# EasyEDA schematic BIT 6.json
TITLE: TRICORE | ALU | CMP; REV: 1.0; Date: 2022-01-05; Sheet: 2/8; Drawn By: Koehler, Paul; Company: komed3
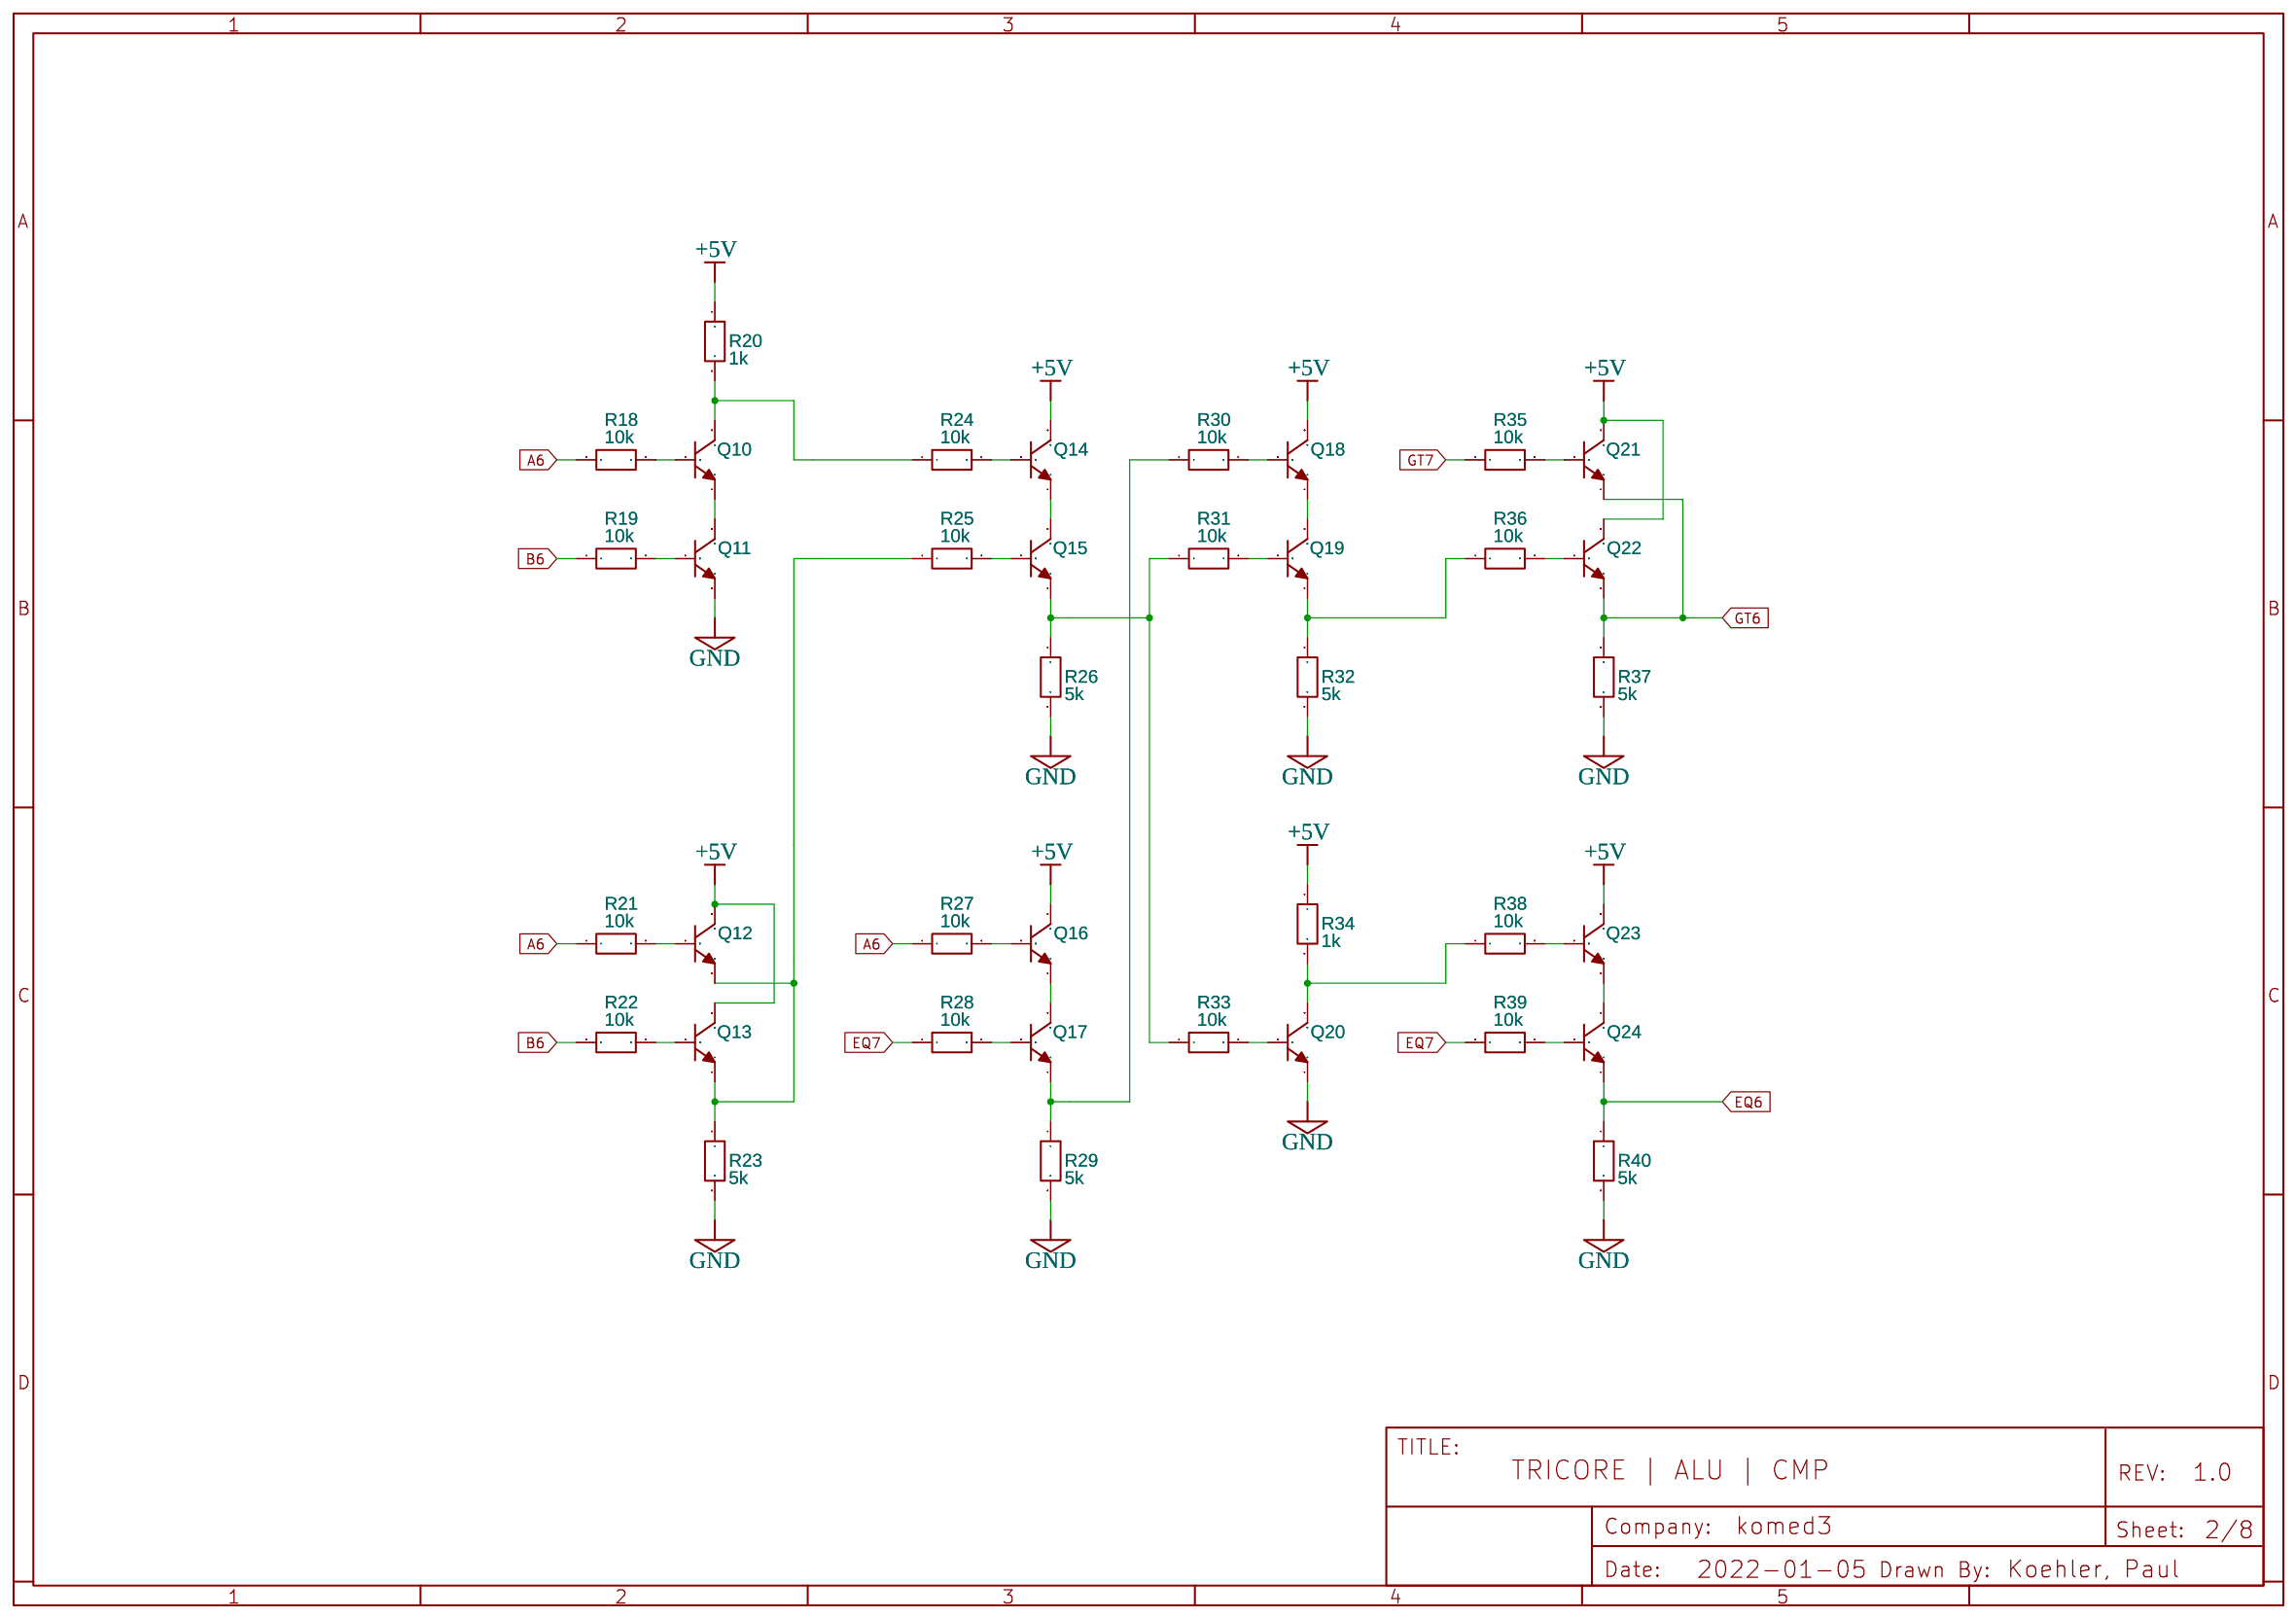
[diagram p0: schematic sheet]

## Parts
Q10  2N3904(TO-92)  [TO-92-3_L5.1-W4.1-P1.27-L]
Q11  2N3904(TO-92)  [TO-92-3_L5.1-W4.1-P1.27-L]
Q12  2N3904(TO-92)  [TO-92-3_L5.1-W4.1-P1.27-L]
Q13  2N3904(TO-92)  [TO-92-3_L5.1-W4.1-P1.27-L]
Q14  2N3904(TO-92)  [TO-92-3_L5.1-W4.1-P1.27-L]
Q15  2N3904(TO-92)  [TO-92-3_L5.1-W4.1-P1.27-L]
Q16  2N3904(TO-92)  [TO-92-3_L5.1-W4.1-P1.27-L]
Q17  2N3904(TO-92)  [TO-92-3_L5.1-W4.1-P1.27-L]
Q18  2N3904(TO-92)  [TO-92-3_L5.1-W4.1-P1.27-L]
Q19  2N3904(TO-92)  [TO-92-3_L5.1-W4.1-P1.27-L]
Q20  2N3904(TO-92)  [TO-92-3_L5.1-W4.1-P1.27-L]
Q21  2N3904(TO-92)  [TO-92-3_L5.1-W4.1-P1.27-L]
Q22  2N3904(TO-92)  [TO-92-3_L5.1-W4.1-P1.27-L]
Q23  2N3904(TO-92)  [TO-92-3_L5.1-W4.1-P1.27-L]
Q24  2N3904(TO-92)  [TO-92-3_L5.1-W4.1-P1.27-L]
R18  10k  [R_AXIAL-0.3]
R19  10k  [R_AXIAL-0.3]
R20  1k  [R_AXIAL-0.3]
R21  10k  [R_AXIAL-0.3]
R22  10k  [R_AXIAL-0.3]
R23  5k  [R_AXIAL-0.3]
R24  10k  [R_AXIAL-0.3]
R25  10k  [R_AXIAL-0.3]
R26  5k  [R_AXIAL-0.3]
R27  10k  [R_AXIAL-0.3]
R28  10k  [R_AXIAL-0.3]
R29  5k  [R_AXIAL-0.3]
R30  10k  [R_AXIAL-0.3]
R31  10k  [R_AXIAL-0.3]
R32  5k  [R_AXIAL-0.3]
R33  10k  [R_AXIAL-0.3]
R34  1k  [R_AXIAL-0.3]
R35  10k  [R_AXIAL-0.3]
R36  10k  [R_AXIAL-0.3]
R37  5k  [R_AXIAL-0.3]
R38  10k  [R_AXIAL-0.3]
R39  10k  [R_AXIAL-0.3]
R40  5k  [R_AXIAL-0.3]

## Library data of the parts
Q10-Q24 = 2N3904(TO-92): Supplier: LCSC; Manufacturer: SEMTECH; Manufacturer Part: 2N3904; Supplier Part: C118538; Contributor: LCEDA_Lib
R18-R40 = R_AXIAL-0.3_EU: Contributor: LCEDA_Lib

## Nets
+5V: Q12.3(C) Q13.3(C) Q14.3(C) Q16.3(C) Q18.3(C) Q21.3(C) Q22.3(C) Q23.3(C) R20.1 R34.1
GND: Q11.1(E) Q20.1(E) R23.2 R26.2 R29.2 R32.2 R37.2 R40.2
A6: R18.1 R21.1 R27.1
B6: R19.1 R22.1
EQ6: Q24.1(E) R40.1
EQ7: R28.1 R39.1
GT6: Q21.1(E) Q22.1(E) R37.1
GT7: R35.1
Net-(Q10-1): Q10.1(E) Q11.3(C)
Net-(Q10-2): Q10.2(B) R18.2
Net-(Q10-3): Q10.3(C) R20.2 R24.1
Net-(Q11-2): Q11.2(B) R19.2
Net-(Q12-1): Q12.1(E) Q13.1(E) R23.1 R25.1
Net-(Q12-2): Q12.2(B) R21.2
Net-(Q13-2): Q13.2(B) R22.2
Net-(Q14-1): Q14.1(E) Q15.3(C)
Net-(Q14-2): Q14.2(B) R24.2
Net-(Q15-1): Q15.1(E) R26.1 R31.1 R33.1
Net-(Q15-2): Q15.2(B) R25.2
Net-(Q16-1): Q16.1(E) Q17.3(C)
Net-(Q16-2): Q16.2(B) R27.2
Net-(Q17-1): Q17.1(E) R29.1 R30.1
Net-(Q17-2): Q17.2(B) R28.2
Net-(Q18-1): Q18.1(E) Q19.3(C)
Net-(Q18-2): Q18.2(B) R30.2
Net-(Q19-1): Q19.1(E) R32.1 R36.1
Net-(Q19-2): Q19.2(B) R31.2
Net-(Q20-2): Q20.2(B) R33.2
Net-(Q20-3): Q20.3(C) R34.2 R38.1
Net-(Q21-2): Q21.2(B) R35.2
Net-(Q22-2): Q22.2(B) R36.2
Net-(Q23-1): Q23.1(E) Q24.3(C)
Net-(Q23-2): Q23.2(B) R38.2
Net-(Q24-2): Q24.2(B) R39.2
